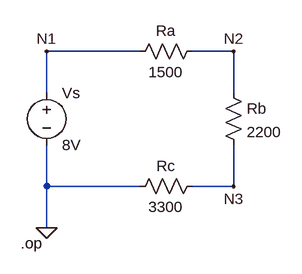
[diagram p0: schematic Circuito 2.asc]
Circuito 2.asc, the LTspice schematic file:
Version 4.1
SHEET 1 880 680
WIRE 224 80 80 80
WIRE 368 80 304 80
WIRE 80 144 80 80
WIRE 368 144 368 80
WIRE 80 288 80 224
WIRE 224 288 80 288
WIRE 368 288 368 224
WIRE 368 288 304 288
WIRE 80 352 80 288
FLAG 80 80 N1
FLAG 80 352 0
FLAG 368 80 N2
FLAG 368 288 N3
SYMBOL voltage 80 128 R0
SYMATTR InstName Vs
SYMATTR Value 8V
SYMBOL res 320 64 R90
WINDOW 0 0 56 VBottom 2
WINDOW 3 32 56 VTop 2
SYMATTR InstName Ra
SYMATTR Value 1500
SYMBOL res 352 128 R0
SYMATTR InstName Rb
SYMATTR Value 2200
SYMBOL res 320 272 R90
WINDOW 0 0 56 VBottom 2
WINDOW 3 32 56 VTop 2
SYMATTR InstName Rc
SYMATTR Value 3300
TEXT 40 376 Left 2 !.op

The netlist it stands for:
* Circuito 2.asc
Vs N1 0 8V
Ra N2 N1 1500
Rb N2 N3 2200
Rc N3 0 3300
.op
.backanno
.end